# EAGLE design 165AMP_NG_V2 (EAGLE 6.4)
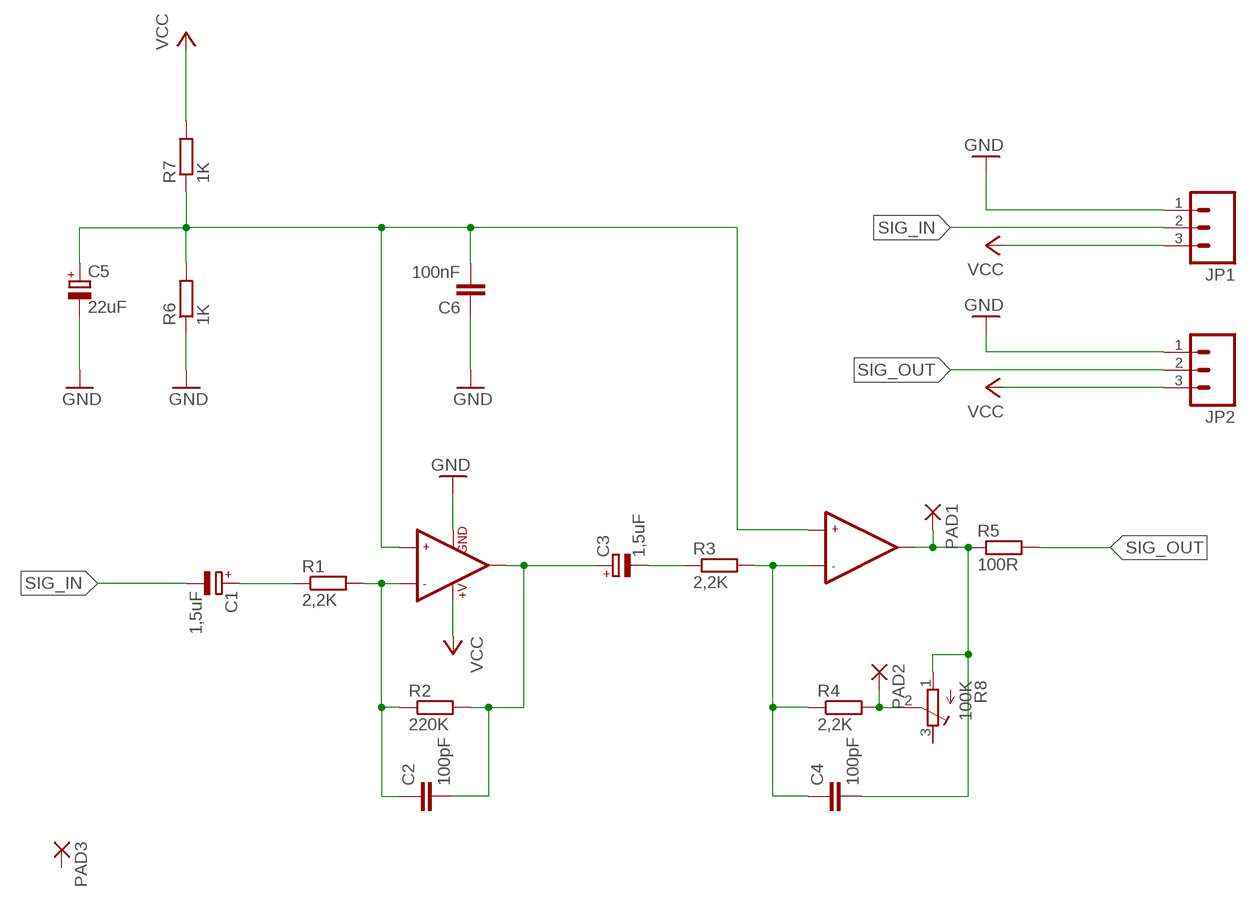
[diagram p0: schematic, sheet 1]

## Parts
C1  1,5uF  CPOL-EUCT6032  [CT6032]
C2  100pF  C-EUC0805  [C0805]
C3  1,5uF  CPOL-EUCT6032  [CT6032]
C4  100pF  C-EUC0805  [C0805]
C5  22uF  CPOL-EUCT6032  [CT6032]
C6  100nF  C-EUC0805  [C0805]
IC1  LMV358  [SO08]
JP1  M03PTH  [1X03]
JP2  M03PTH  [1X03]
PAD1  1,6/0,8  [1,6/0,8]
PAD2  1,6/0,8  [1,6/0,8]
PAD3  1,6/0,8  [1,6/0,8]
R1  2,2K  R-EU_R1206  [R1206]
R2  220K  R-EU_R1206  [R1206]
R3  2,2K  R-EU_R1206  [R1206]
R4  2,2K  R-EU_R1206  [R1206]
R5  100R  R-EU_R1206  [R1206]
R6  1K  R-EU_R1206  [R1206]
R7  1K  R-EU_R1206  [R1206]
R8  100K  R-TRIMMTS63Z  [RTRIMTS63Z]

## Nets
GND: C5.- C6.1 IC1.4(GND) JP1.1 JP2.1 R6.1
N$1: C1.+ R1.1
N$2: C2.1 IC1.2(-IN1) R1.2 R2.1
N$3: C2.2 C3.+ IC1.1(OUT1) R2.2
N$5: C3.- R3.1
N$6: C4.1 IC1.6(-IN2) R3.2 R4.1
N$7: C4.2 IC1.7(OUT2) PAD1.1(P) R5.1 R8.1(E)
N$8: PAD2.1(P) R4.2 R8.2(S)
N$9: C5.+ C6.2 IC1.3(+IN1) IC1.5(+IN2) R6.2 R7.1
SIG_IN: C1.- JP1.2
SIG_OUT: JP2.2 R5.2
VCC: IC1.8(+V) JP1.3 JP2.3 R7.2
Unconnected: PAD3.1(P) R8.3(A)

## Library data of the parts
C1 C3 C5 = resistor:CPOL-EU: POLARIZED CAPACITOR, European symbol
C2 C4 C6 = rcl:C-EU: CAPACITOR, European symbol
IC1 = SparkFun:LMV358
JP1 JP2 = SparkFun:M03: Header 3 Standard 3-pin 0.1" header. Use with straight break away headers (SKU : PRT-00116), right angle break away headers (PRT-00553), swiss pins (PRT-00743), machine pins (PRT-00117), and female headers (PRT-00115). Molex polarized connector foot print use with SKU : PRT-08232 with associated crimp pins and housings.
PAD1-PAD3 = wirepad:1,6/0,8: THROUGH-HOLE PAD
R1-R7 = rcl:R-EU_: RESISTOR, European symbol
R8 = resistor:R-TRIMM: Trimm resistor

## Board
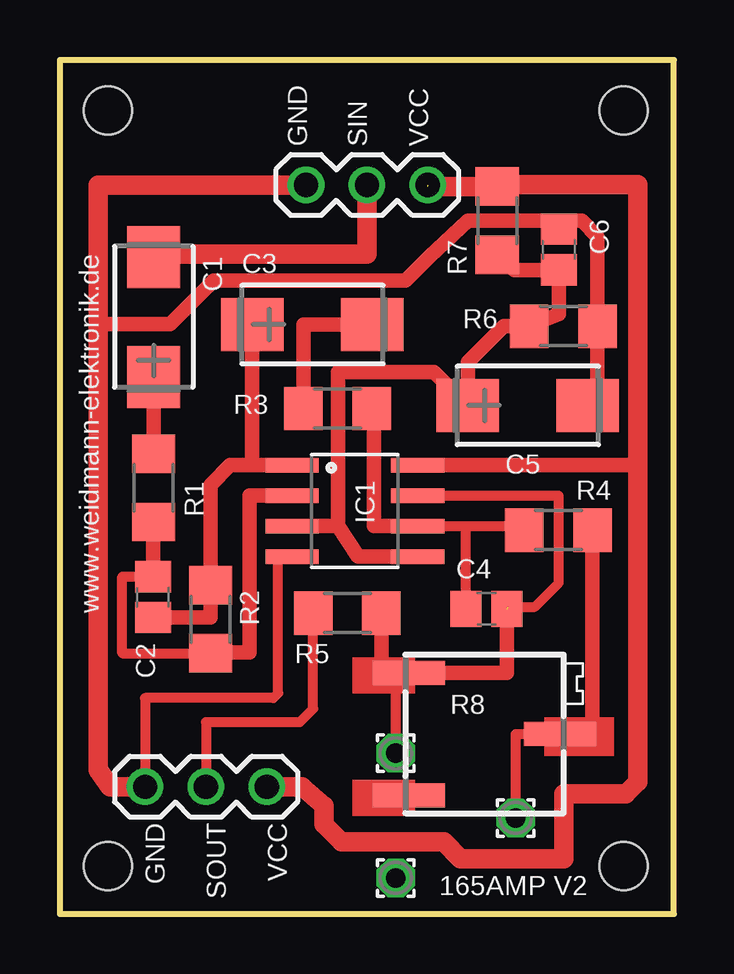
[diagram p1: board, top side]
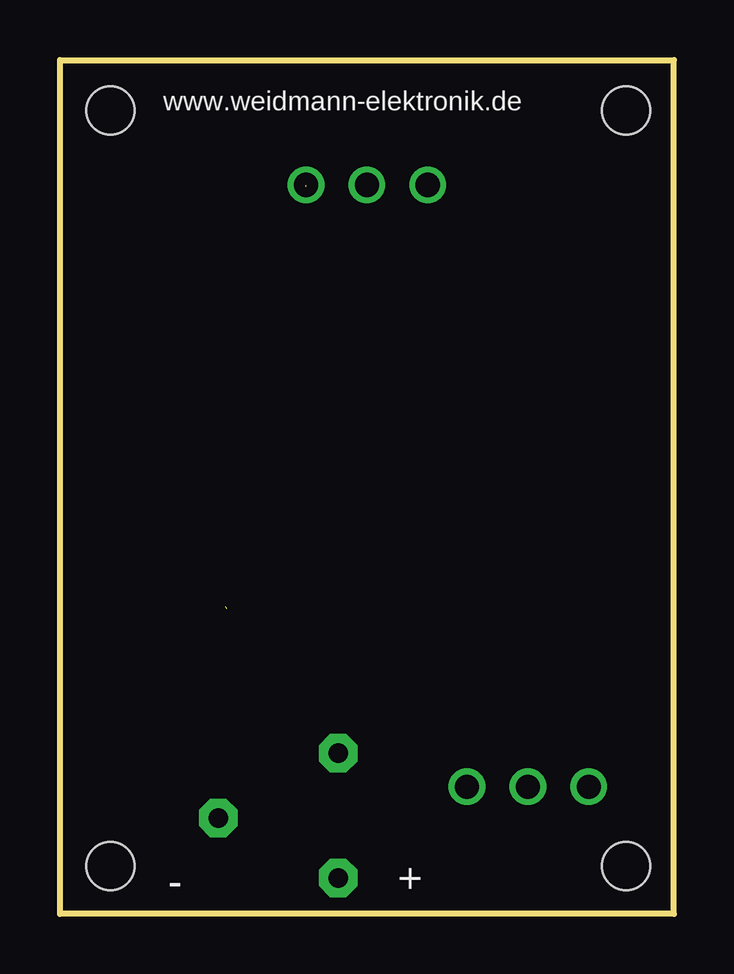
[diagram p2: board, bottom side, seen from below]

Size 25.6 x 35.6 mm. Coordinates in mm from the lower left corner, seen from the top.
Outline: 0,0 0,35.6 25.6,35.6 25.6,0 0,0
Copper layers (1*16): Top 0.035mm / dielectric 1.5mm / Bottom 0.035mm
Design rules "default": minimum track width 10mil, minimum drill 24mil, track to track 8mil, track to pad 8mil, pad to pad 8mil, via to via 8mil, smd to smd 8mil, copper to edge 40mil, drill to drill 8mil, minimum pad ring 10mil, minimum via ring 8mil, stop-mask expansion 4mil, vias tented up to drill 0mil, thermal gap 10mil
Holes 2 mm at 2,33.5 23.5,33.5 2,2 23.5,2

### Footprints (pad centres in the part's own frame; a part is rotated, then mirrored left to right if it is on the bottom)
CT6032 = smd 2.6 x 2.2: + 2.5,0; - -2.5,0
C0805 = smd 1.3 x 1.5: 1 -0.85,0; 2 0.85,0
SO08 = smd 0.61 x 2.21: 1 -1.905,-2.616; 2 -0.635,-2.616; 3 0.635,-2.616; 4 1.905,-2.616; 5 1.905,2.616; 6 0.635,2.616; 7 -0.635,2.616; 8 -1.905,2.616
1X03 = drill 1.016: 1 0,0; 2 2.54,0; 3 5.08,0
1,6/0,8 = drill 0.813 pad 1.6 octagon: 1 0,0
R1206 = smd 1.6 x 1.803: 1 -1.422,0; 2 1.422,0
RTRIMTS63Z = smd 1 x 3: 1 -2.55,-3.15; 2 0,3.15; 3 2.55,-3.15

### Placement (x,y rotation side)
C1  3.91,24.88 270 top
C2  3.88,13.21 270 top
C3  10.52,24.57 180 top
C4  17.78,12.72 0 top
C5  19.5,21.2 180 top
C6  20.8,27.7 270 top
IC1  12.3,16.8 270 top
JP1  10.26,30.39 0 top
JP2  3.55,5.3 0 top
PAD1  14,6.7 0 top
PAD2  19,4 0 top
PAD3  14,1.5 0 top
R1  3.91,17.76 270 top
R2  6.28,12.29 90 top
R3  11.57,21.07 0 top
R4  20.78,16 0 top
R5  11.98,12.54 180 top
R6  20.99,24.5 180 top
R7  18.23,28.9 90 top
R8  17.7,7.5 270 top

### Tracks (layer width: path | path; a pad name or v marks a point on that pad's centre or on a via)
GND
  Top 0.406: 22.41,20.8 C5.- | IC1.4 9.1,14.89 9.1,9.2 8.9,9 3.55,9 JP2.1
  Top 0.61: 22.41,20.8 R6.1 22.41,28.24 21.75,28.9 20.17,28.9 | 1.6,24.6 4.6,24.6 6.4,26.4 14.4,26.4 15.4,27.4 17,28.9 20.17,28.9 | 20.17,28.9 C6.1
  Top 0.813: JP1.1 1.6,30.39 1.6,24.6 1.6,6 2.1,5.3 JP2.1
N$1
  Top 0.61: R1.1 C1.+
N$2
  Top 0.406: 3.88,16.31 R1.2 | C2.1 2.6,14.06 2.6,10.87 R2.1 6.28,10.9
  Top 0.61: C2.1 3.88,16.31 | IC1.2 7.9,17.43 7.9,10.9 6.28,10.9
N$3
  Top 0.61: C2.2 6.28,12.36 R2.2 6.28,17.89 7.1,18.7 8.02,18.7 | 8.02,18.7 IC1.1 | 8.02,18.7 C3.+
N$5
  Top 0.406: C3.- 13.02,24.25
  Top 0.61: R3.1 10.15,24.57 C3.-
N$6
  Top 0.406: IC1.6 16.9,16.16 | 16.9,16.16 19.19,16.16 arc-90 R4.1 | C4.1 16.9,14.29 16.9,16.16
  Top 0.61: R3.2 13.1,21.11 13.1,16.16 IC1.6
N$7  (1 unrouted)
  Top 0.406: IC1.7 20.8,17.43 20.8,13.8 19.8,12.8 18.7,12.8 | R8.1 14,9.5 PAD1.1
  Top 0.61: C4.2 18.63,10.05 R8.1 13.4,10.05 R5.1
N$8
  Top 0.406: 22.2,7.5 R8.2 19,7.5 PAD2.1
  Top 0.61: 22.2,7.5 R4.2
N$9
  Top 0.406: 19.48,23.9 R6.2
  Top 0.61: IC1.3 11.6,16.16 | IC1.5 12.43,14.89 11.6,16.16 | 11.6,16.16 11.6,22.6 15.6,22.6 C5.+ 17,23 18.5,24.5 R6.2 20.8,25 C6.2 18.96,26.85 R7.1
SIG_IN
  Top 0.813: C1.- 4.7,27.38 4.7,27.5 12.8,27.5 JP1.2
SIG_OUT
  Top 0.406: R5.2 10.56,8.56 10,8 6.09,8 JP2.2
VCC  (1 unrouted)
  Top 0.61: 24.1,18.7 IC1.8
  Top 0.813: 15.34,30.32 R7.2 18.23,30.4 24.1,30.4 24.1,18.7 24.1,5.5 23.6,5 21,5 21,2.3 16.7,2.3 16,3 11.73,3 11,3.73 11,4.5 10.1,5.3 JP2.3
(copper drawn outside any net)
  shapes: Top area x3

### Text on the board
tPlace: GND | SIN | VCC | www.weidmann-elektronik.de | GND | SOUT | VCC | 165AMP V2
bPlace: www.weidmann-elektronik.de | + | -